# Altium schematic sheet input-port-con.SchDoc: Input Port Connection
size A4
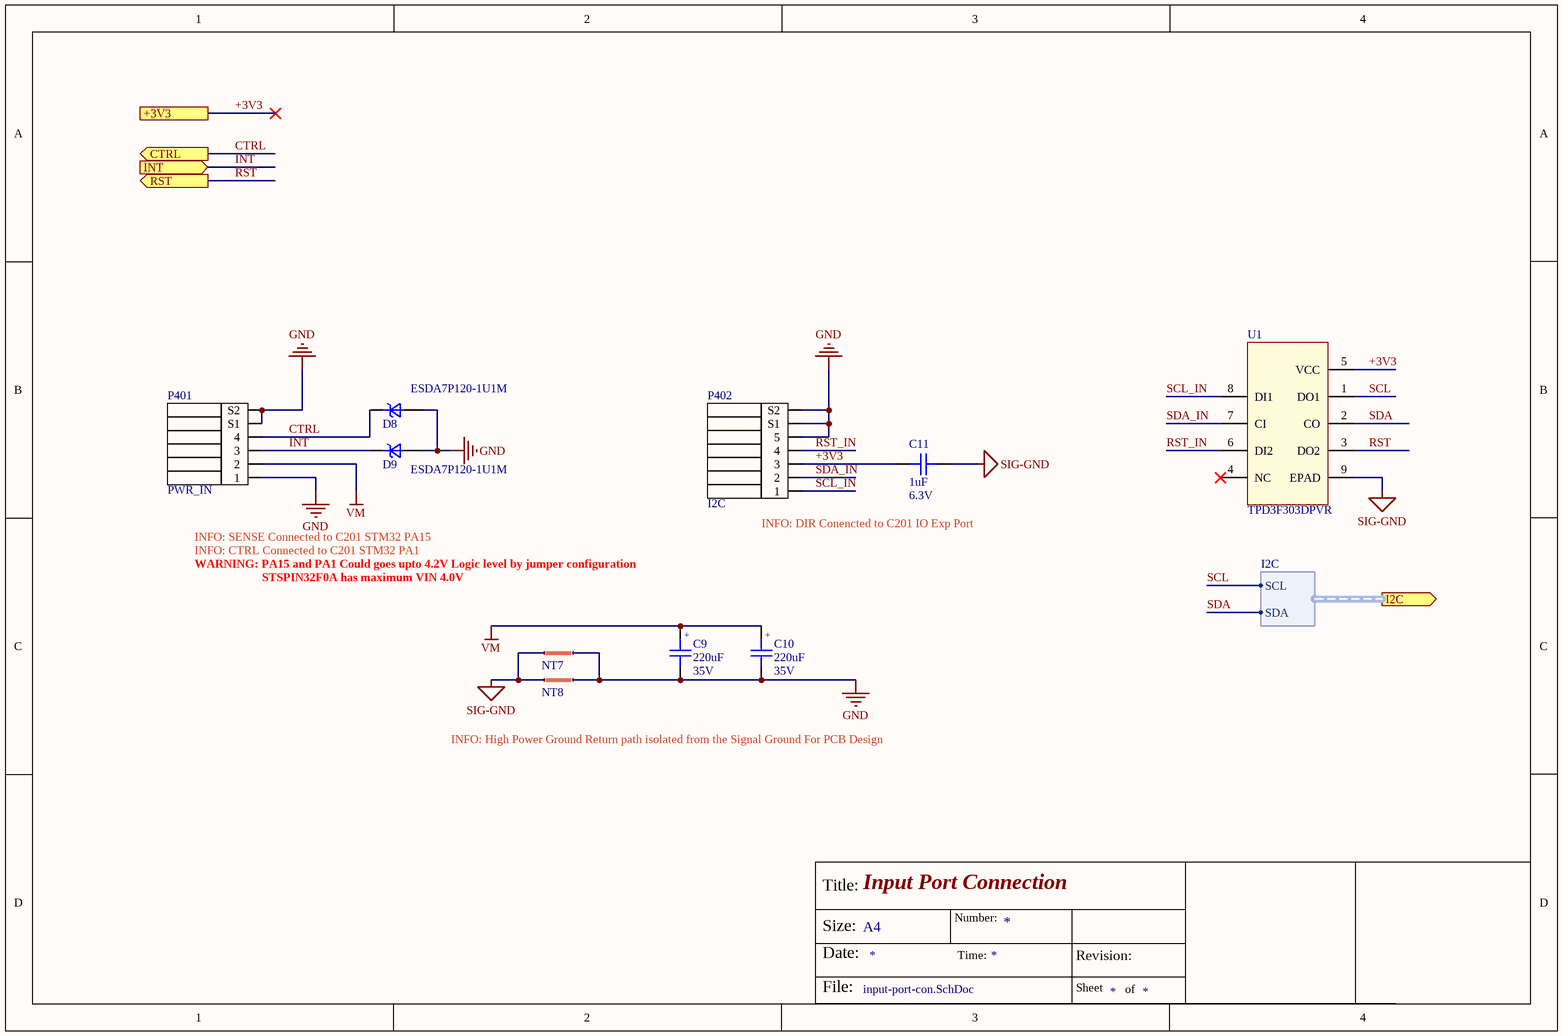
[diagram p0: input-port-con.SchDoc]

## Parts
C9  Capacitance: 220uF  Rated Voltage: 35V  [WCAP-ASLI_D8H10.5]  (hidden comment: CAP ALUM 220 UF 20% 35 V SMD)
C10  Capacitance: 220uF  Rated Voltage: 35V  [WCAP-ASLI_D8H10.5]  (hidden comment: CAP ALUM 220 UF 20% 35 V SMD)
C11  Capacitance: 1uF  Voltage Rating: 6.3V  [C0402]  (hidden comment: CAP CER 1UF 6.3V X5R 0402)
D8  ESDA7P120-1U1M  [ST_QFN_1610]
D9  ESDA7P120-1U1M  [ST_QFN_1610]
NT7  Net Tie  [Net Tie 6x30mil]  (value not drawn)  (net tie, no BOM)
NT8  Net Tie  [Net Tie 6x30mil]  (value not drawn)  (net tie, no BOM)
P401  PWR_IN  [JST_S4B-ZR-SM4A-TF(LF)(SN)]
P402  I2C  [JST_S5B-ZR-SM4A-TF(LF)(SN)]
U1  TPD3F303DPVR  [DPV8_1P7X0P4]

## Ports
+3V3, CTRL (out), I2C (out, harness I2C), INT (in), RST (out)

## Harnesses
I2C: SCL, SDA

## Nets
GND: C9.2 C10.2 D8.2(A) D9.2(A) NT7.2 NT8.2 P401.1 P401.S1 P401.S2 P402.5 P402.S1 P402.S2
SIG-GND: C11.1 NT7.1 NT8.1 U1.9(EPAD)
VM: C9.1 C10.1 P401.2
+3V3: C11.2 P402.3 U1.5(VCC) ; port +3V3
CTRL: D8.1(K) P401.4 ; port CTRL
INT: D9.1(K) P401.3 ; port INT
RST: U1.3(DO2) ; port RST
RST_IN: P402.4 U1.6(DI2)
SCL: U1.1(DO1) ; port I2C.SCL
SCL_IN: P402.1 U1.8(DI1)
SDA: U1.2(CO) ; port I2C.SDA
SDA_IN: P402.2 U1.7(CI)

Not connected (* = marked no-connect by the designer): U1 4(NC)*

## Notes on the sheet
- INFO: SENSE Connected to C201 STM32 PA15
- WARNING: PA15 and PA1 Could goes upto 4.2V Logic level by jumper configuration
- INFO: CTRL Connected to C201 STM32 PA1
- STSPIN32F0A has maximum VIN 4.0V
- (near P402) INFO: DIR Conencted to C201 IO Exp Port
- INFO: High Power Ground Return path isolated from the Signal Ground For PCB Design
- Title:
- Number:
- Size:
- Date:
- A4
- Time:
- Revision:
- Sheet
- File:
- of
- (in symbol CAP ALUM 220 UF 20% 35 V SMD) +

## Library data of the parts
C9 C10 = CAP ALUM 220 UF 20% 35 V SMD: 220µF 35V Aluminum Electrolytic Capacitors Radial, Can - SMD  2000 Hrs @ 105°C; Manufacturer: Wurth Elektronik; Manufacturer Part Number: 865080553014; Dissipation Factor: 14%; Endurance: 2000h; Leakage Current: 77uA; Ripple Current: 570mA; Capacitance Tolerance: +/-20%; Packaging: Tape and Reel; ComponentLink1URL: http://www.we-online.de; ComponentLink1Description: Manufacturer; Diameter: 8mm; Height: 10mm; ComponentLink2URL: https://www.we-online.com/catalog/datasheet/865080553014.pdf; ComponentLink2Description: Datasheet; Mounting Technology: SMT; Operating Temperature: -55 to +105degC; Published Date: Nov 2014; Mount: Surface Mount; Supplier 1: Digi-Key; Supplier Part Number 1: 732-8513-1-ND
C11 = CAP CER 1UF 6.3V X5R 0402: 1µF ±10% 6.3V Ceramic Capacitor X5R 0402 (1005 Metric); Manufacturer: Yageo; Manufacturer Part Number: CC0402KRX5R5BB105; Supplier 1: Digi-Key; Stock 1: 34926286; Pricing 1: 1=0.1, 10=0.05, 50=0.0272, 100=0.0222, 500=0.0158, 1000=0.0124, 2500=0.0113, 5000=0.0104 (USD); Mount: Surface Mount; Number of Pins: 2; Case Code (Imperial): 0402; Case Code (Metric): 1005; Min Operating Temperature: -55°C; Max Operating Temperature: 85°C; Tolerance: 10%; Packaging: Tape and Reel; Termination: SMD/SMT; Voltage Rating (DC): 6.3V; Composition: Ceramic; Length: 1mm; Height: 0.5mm; Width: 0.02inch; Thickness: 0.022inch; Depth: 0.5mm; Radiation Hardening: No; Lead Free: Lead Free; Halogen Free: Halogen Free; ComponentLink1URL: http://www.farnell.com/datasheets/70765.pdf?src-supplier=Farnell; ComponentLink1Description: http://www.farnell.com/datasheets/70765.pdf?src-supplier=Farnell; Supplier Part Number 1: 311-1438-1-ND; Dielectric: X5R; Case/Package: 0402; Dielectric Material: Ceramic; Package Quantity: 1; REACH SVHC: No SVHC; ComponentLink2URL: http://www.yageo.com/documents/recent/UPY-GPHC_X5R_4V-to-50V_25.pdf?src-supplier=Digi-Key; ComponentLink2Description: http://www.yageo.com/documents/recent/UPY-GPHC_X5R_4V-to-50V_25.pdf?src-supplier=Digi-Key; ComponentLink3URL: http://www.farnell.com/datasheets/2167237.pdf?src-supplier=Element14; ComponentLink3Description: http://www.farnell.com/datasheets/2167237.pdf?src-supplier=Element14; ComponentLink4URL: http://www.yageo.com/documents/recent/UPY-GPHC_X5R_4V-to-50V_12.pdf?src-supplier=Avnet+Europe; ComponentLink4Description: http://www.yageo.com/documents/recent/UPY-GPHC_X5R_4V-to-50V_12.pdf?src-supplier=Avnet+Europe; ComponentLink5URL: http://www.farnell.com/datasheets/1359354.pdf?src-supplier=Element14; ComponentLink5Description: http://www.farnell.com/datasheets/1359354.pdf?src-supplier=Element14; ComponentLink6URL: http://www.farnell.com/datasheets/70765.pdf?src-supplier=Element14; ComponentLink6Description: http://www.farnell.com/datasheets/70765.pdf?src-supplier=Element14; ComponentLink7URL: http://www.yageo.com/documents/recent/UPY-GPHC_X5R_4V-to-50V_12.pdf?src-supplier=Avnet; ComponentLink7Description: http://www.yageo.com/documents/recent/UPY-GPHC_X5R_4V-to-50V_12.pdf?src-supplier=Avnet
D8 D9 = TVS DIODE ESDA7P120-1U1M 5.5V 11.5V 1610: 11.5V Clamp 120A (8/20µs) Ipp Tvs Diode Surface Mount 1610; Manufacturer: STMicroelectronics; Number of Unidirectional Channels: 1; Reverse Standoff Voltage: 5.5V; Min Breakdown Voltage: 6.4V; Peak Pulse Power: 1.4kW; Power Line Protection: No; Supplier 1: Digi-Key; Manufacturer Part Number: ESDA7P120-1U1M; Stock 1: 15775; Pricing 1: 1=0.35, 10=0.287, 25=0.2624, 100=0.1647, 250=0.1629, 500=0.1525, 1000=0.1037, 2500=0.0994 (USD); Mount: Surface Mount; Case/Package: 0603; Case Code (Imperial): 0603; Case Code (Metric): 1610; Min Operating Temperature: -55°C; Max Operating Temperature: 150°C; Composition: Zener; Packaging: Cut Tape; Clamping Voltage: 11.5V; Peak Pulse Current: 120A; ComponentLink1URL: http://www.st.com/content/ccc/resource/technical/document/datasheet/group3/5e/7c/5d/76/3f/de/45/35/DM00359316/files/DM00359316.pdf/jcr:content/translations/en.DM00359316.pdf?src-supplier=Digi-Key; ComponentLink1Description: http://www.st.com/content/ccc/resource/technical/document/datasheet/group3/5e/7c/5d/76/3f/de/45/35/DM00359316/files/DM00359316.pdf/jcr:content/translations/en.DM00359316.pdf?src-supplier=Digi-Key; ComponentLink2URL: http://www.farnell.com/datasheets/2815837.pdf?src-supplier=Newark; ComponentLink2Description: http://www.farnell.com/datasheets/2815837.pdf?src-supplier=Newark; ComponentLink3URL: http://www.farnell.com/datasheets/2815837.pdf?src-supplier=Farnell; ComponentLink3Description: http://www.farnell.com/datasheets/2815837.pdf?src-supplier=Farnell; ComponentLink4URL: http://www.farnell.com/datasheets/2815837.pdf?src-supplier=Element14; ComponentLink4Description: http://www.farnell.com/datasheets/2815837.pdf?src-supplier=Element14; Supplier Part Number 1: 497-17159-1-ND
NT7 NT8 = Net Tie Line: ClassName: STM32G473CETx
P401 = JST_S4B-ZR-SM4A-TF(LF)(SN): Connector Header SMD, Right Angle 4 position 0.059" (1.50mm); Manufacturer: JST; Manufacturer Part Number: S5B-ZR-SM4A-TF; Body Plating: Tin; Number of Positions: 4; Connector Type: Header,Male Pin; Voltage Rating: 50V; Contact Resistance: 30mR; Max Current Rating: 1A; Insulation Resistance: 500MR; Gender: Male; Pitch: 1.5mm; Panel Thickness: 3.5mm; Stock 1: 0; Mount: Surface Mount; Number of Pins: 4; Color: White; Contact Plating: Tin,Copper; Contact Material: Brass,Tin,Copper; Material: Nylon; Housing Color: Beige; Housing Material: Polyamide; Contact Shape: Circular; Insulation Material: Nylon; Insulation Color: Natural; Min Operating Temperature: -25°C; Max Operating Temperature: 85°C; Packaging: Bulk; Number of Rows: 1; Termination: Solder; Voltage Rating (DC): 50V; Current Rating: 1A; Voltage Rating (AC): 50V; Fastening Type: Detent; Max Voltage Rating (AC): 50V; Max Voltage Rating (DC): 50V; Number of Contacts: 4; Orientation: Right Angle; Length: 7.5mm; Height: 7.2mm; Width: 3.5mm; Depth: 6mm; Lead Pitch: 1.5mm; Contact Mating Length: 0.094inch; REACH SVHC: No SVHC; Lead Free: Lead Free; Flammability Rating: UL94 V-0; ComponentLink4URL: http://www.jst-mfg.com/product/pdf/eng/eZH.pdf?src-supplier=Digi-Key; ComponentLink4Description: http://www.jst-mfg.com/product/pdf/eng/eZH.pdf?src-supplier=Digi-Key; Supplier 1: RSComponents; Supplier Part Number 1: 7620881P
P402 = JST_S5B-ZR-SM4A-TF(LF)(SN): Connector Header SMD, Right Angle 4 position 0.059" (1.50mm); Manufacturer: JST; Body Plating: Tin; Number of Positions: 4; Connector Type: Header,Male Pin; Voltage Rating: 50V; Contact Resistance: 30mR; Max Current Rating: 1A; Insulation Resistance: 500MR; Gender: Male; Pitch: 1.5mm; Panel Thickness: 3.5mm; Manufacturer Part Number: S5B-ZR-SM4A-TF; Stock 1: 0; Mount: Surface Mount; Number of Pins: 4; Color: White; Contact Plating: Tin,Copper; Contact Material: Brass,Tin,Copper; Material: Nylon; Housing Color: Beige; Housing Material: Polyamide; Contact Shape: Circular; Insulation Material: Nylon; Insulation Color: Natural; Min Operating Temperature: -25°C; Max Operating Temperature: 85°C; Packaging: Bulk; Number of Rows: 1; Termination: Solder; Voltage Rating (DC): 50V; Current Rating: 1A; Voltage Rating (AC): 50V; Fastening Type: Detent; Max Voltage Rating (AC): 50V; Max Voltage Rating (DC): 50V; Number of Contacts: 4; Orientation: Right Angle; Length: 7.5mm; Height: 7.2mm; Width: 3.5mm; Depth: 6mm; Lead Pitch: 1.5mm; Contact Mating Length: 0.094inch; REACH SVHC: No SVHC; Lead Free: Lead Free; Flammability Rating: UL94 V-0; ComponentLink4URL: https://www.jst-mfg.com/product/pdf/eng/eZH.pdf; ComponentLink4Description: http://www.jst-mfg.com/product/pdf/eng/eZH.pdf?src-supplier=Digi-Key; Supplier 1: RSComponents; Supplier Part Number 1: 7620881P
U1 = FILTER RC(PI) ESD SMD  8-UFDFN EP: RC (Pi) EMI Filter 2nd Order Low Pass 3 Channel R = 47Ohms, 100Ohms, C = 20pF  8-UFDFN Exposed Pad; Manufacturer: Texas Instruments; Number of Channels: 3; Frequency: 308MHz; ESD Protection: Yes; Operating Supply Voltage: 5.5V; Clamping Voltage: 10V; Supplier 1: Digi-Key; Manufacturer Part Number: TPD3F303DPVR; Stock 1: 4896; Pricing 1: 1=0.85, 10=0.812, 25=0.7856, 50=0.6414, 100=0.576, 250=0.5236, 500=0.4974, 1000=0.4451 (USD); Case/Package: SMD/SMT; Min Operating Temperature: -40°C; Max Operating Temperature: 85°C; Packaging: Tape and Reel; ComponentLink1URL: http://www.ti.com/lit/ds/symlink/tpd3f303.pdf?src-supplier=Digi-Key; ComponentLink1Description: http://www.ti.com/lit/ds/symlink/tpd3f303.pdf?src-supplier=Digi-Key; ComponentLink2URL: http://focus.ti.com/lit/ds/symlink/tpd3f303.pdf?src-supplier=Avnet+Europe; ComponentLink2Description: http://focus.ti.com/lit/ds/symlink/tpd3f303.pdf?src-supplier=Avnet+Europe; ComponentLink3URL: https://www.verical.com/server-webapp/html/getDatasheet?partID=302817&src-supplier=Verical; ComponentLink3Description: https://www.verical.com/server-webapp/html/getDatasheet?partID=302817&src-supplier=Verical; ComponentLink4URL: http://www.farnell.com/datasheets/1558442.pdf?src-supplier=Element14; ComponentLink4Description: http://www.farnell.com/datasheets/1558442.pdf?src-supplier=Element14; Supplier Part Number 1: 296-28299-1-ND; Number of Pins: 8; Contact Plating: Gold; Package Quantity: 1; Capacitance: 20pF; Termination: Flat; Length: 2.2mm; Height: 0.026inch; Width: 0.063inch; Depth: 1.7mm; Radiation Hardening: No; Lead Free: Lead Free; REACH SVHC: No SVHC; Mount: Surface Mount